# Altium schematic sheet ESP32.SchDoc
size A4
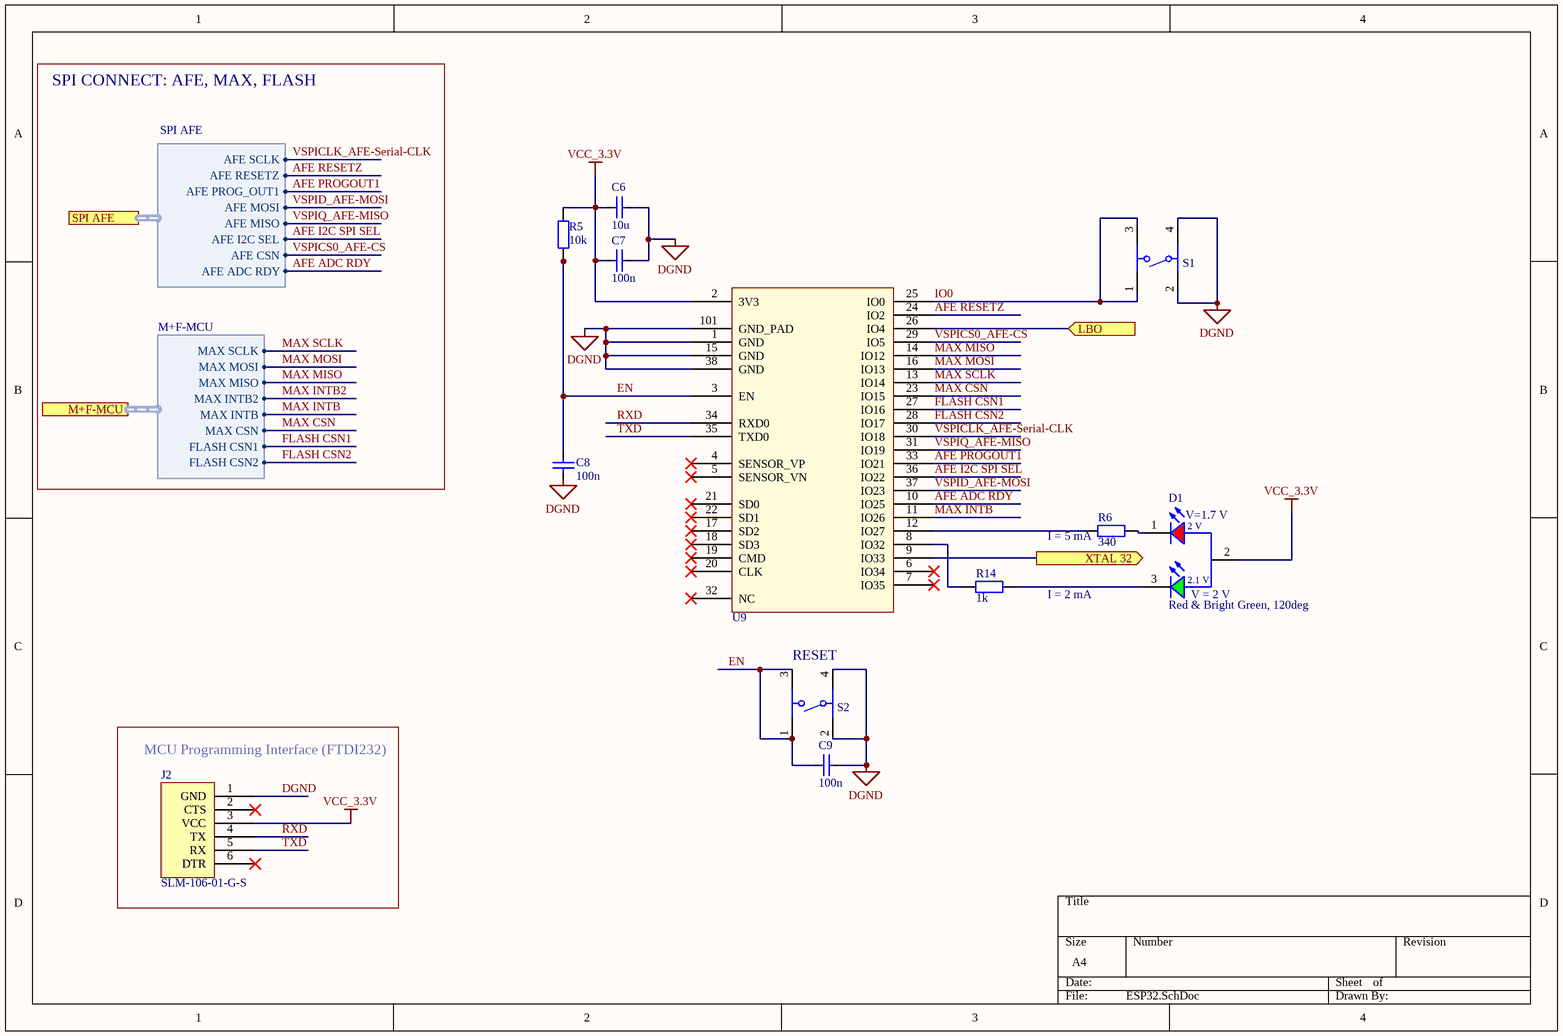
[diagram p0: ESP32.SchDoc]

## Parts
C6  10u  [CAPC1608X05N]
C7  100n  [CAPC1005X03N]
C8  100n  [CAPC1005X03N]
C9  100n  [CAPC1005X03N]
D1  Red & Bright Green, 120deg  [WL-SBSW_1204]
J2  SLM-106-01-G-S  [SLM-106-01-G-S]
R5  10k  [RESC1005X03N]
R6  340  [RESC1005X03N]
R14  1k  [RESC1005X03N]
S1  434153017835  [434153017835]  (value not drawn)
S2  434153017835  [434153017835]  (value not drawn)
U9  ESP32  [ESP32-WROOM-32]  (value not drawn)

## Blocks framed on the sheet
MCU Programming Interface (FTDI232): J2

## Ports
LBO (in), M+F-MCU (harness M+F-MCU), SPI AFE (harness SPI AFE), XTAL 32 (out)

## Harnesses
M+F-MCU: MAX CSN, MAX INTB, MAX INTB2, MAX MISO, MAX MOSI, MAX SCLK, FLASH CSN1, FLASH CSN2
SPI AFE: AFE ADC RDY, AFE CSN, AFE I2C SEL, AFE MISO, AFE MOSI, AFE PROG_OUT1, AFE RESETZ, AFE SCLK

## Nets
DGND: C6.2 C7.2 C8.1 C9.2 J2.1(GND) S1.2 S1.4 S2.2 S2.4 U9.1(GND) U9.15(GND) U9.38(GND) U9.101(GND_PAD)
VCC_3.3V: C6.1 C7.1 D1.2(A) J2.3(VCC) R5.2 U9.2(3V3)
AFE ADC RDY: U9.10(IO25) ; port SPI AFE.AFE ADC RDY
AFE I2C SPI SEL: U9.36(IO22) ; port SPI AFE.AFE I2C SEL
AFE PROGOUT1: U9.33(IO21) ; port SPI AFE.AFE PROG_OUT1
AFE RESETZ: U9.24(IO2) ; port SPI AFE.AFE RESETZ
EN: C8.2 C9.1 R5.1 S2.1 S2.3 U9.3(EN)
FLASH CSN1: U9.27(IO16) ; port M+F-MCU.FLASH CSN1
FLASH CSN2: U9.28(IO17) ; port M+F-MCU.FLASH CSN2
IO0: S1.1 S1.3 U9.25(IO0)
LBO: U9.26(IO4) ; port LBO
MAX CSN: U9.23(IO15) ; port M+F-MCU.MAX CSN
MAX INTB: U9.11(IO26) ; port M+F-MCU.MAX INTB
MAX INTB2: port M+F-MCU.MAX INTB2
MAX MISO: U9.14(IO12) ; port M+F-MCU.MAX MISO
MAX MOSI: U9.16(IO13) ; port M+F-MCU.MAX MOSI
MAX SCLK: U9.13(IO14) ; port M+F-MCU.MAX SCLK
RXD: J2.4(TX) U9.34(RXD0)
TXD: J2.5(RX) U9.35(TXD0)
VSPICLK_AFE-Serial-CLK: U9.30(IO18) ; port SPI AFE.AFE SCLK
VSPICS0_AFE-CS: U9.29(IO5) ; port SPI AFE.AFE CSN
VSPID_AFE-MOSI: U9.37(IO23) ; port SPI AFE.AFE MOSI
VSPIQ_AFE-MISO: U9.31(IO19) ; port SPI AFE.AFE MISO
XTAL 32: U9.9(IO33) ; port XTAL 32
NetD1_1: D1.1(K) R6.2
NetD1_3: D1.3(K) R14.2
NetR6_1: R6.1 U9.12(IO27)
NetR14_1: R14.1 U9.8(IO32)

Not connected (* = marked no-connect by the designer): J2 2(CTS)* 6(DTR)*; U9 4(SENSOR_VP)* 5(SENSOR_VN)* 6(IO34)* 7(IO35)* 17(SD2)* 18(SD3)* 19(CMD)* 20(CLK)* 21(SD0)* 22(SD1)* 32(NC)*

## Notes on the sheet
- SPI CONNECT: AFE, MAX, FLASH
- (near D1) V=1.7 V
- (near R6) I = 5 mA
- I = 2 mA
- (near D1) V = 2 V
- (near S2) RESET
- (in symbol 155124RV73200) 2 V; 2.1 V

## Library data of the parts
C6 = C_10u_10V_0603: Kondensator 10u 10V 0603; Supplier 1: Farnell; Supplier Part Number 1: 2521952
C7-C9 = C_100n_50V_0402: Kondensator 100n 50V 0402; Tested: False; Supplier 1: Farnell; Supplier Part Number 1: 2210822
D1 = 155124RV73200: WL-SBSW SMT Bi-color Side View Waterclear, size 1204, Red & Bright Green, 120deg; Luminous Intensity: 60mcd@Red, 30mcd@Bright Green; Dominant Wavelength: 624nm@Red, 571nm@Bright Green; Forward Voltage: 2V@Red, 2.1V@Bright Green; Peak Wavelength: 632nm@Red, 573nm@Bright Green; Chip Technology: AlInGaP; ComponentLink1Description: Manufacturer; ComponentLink1URL: http://www.we-online.de; ComponentLink2Description: Datasheet; ComponentLink2URL: https://katalog.we-online.de/led/datasheet/155124RV73200.pdf; Emitting Color: Red & Bright Green; Operating Temperature: -40 to +85degC; Mounting Technology: SMT; Part Number: 155124RV73200; Packaging: Tape and Reel; Published Date: October 2019; Publisher: Wurth Elektronik; Size: 1204; Viewing Angle: 120deg
R5 = R_10k_0402: Widerstand 10k 1% 0402; Tested: False; Supplier 1: Farnell; Supplier Part Number 1: 1358069
R6 = R_0R_0402: Widerstand 340R 0402; Tested: True; Supplier 1: Farnell; Supplier Part Number 1: 2059190
R14 = R_1k_0402: Widerstand 1k 1% 0402; Tested: False; Supplier 1: Farnell; Supplier Part Number 1: 2447120
S1 S2 = 434153017835: 3.5x2.9mm SMD J-Bend WS-TASV, height 1.7 mm, 350 gf; Rated Current: 50 mA; Operation Force: 350 gf; Rated Voltage: 12 VDC; ComponentLink1Description: Manufacturer; ComponentLink1URL: http://www.we-online.de; ComponentLink2Description: Datasheet; ComponentLink2URL: http://katalog.we-online.de/em/datasheet/434153017835.pdf; Part Number: 434153017835; Published Date: Nov. 2017; Publisher: Wurth Elektronik; Life Cycle: 200000; Operating Temperature: -40 to +85 degC; Size: 3.5x2.9x1.7 mm
U9 = ESP32-WROOM32: Espressiv ESP32-WROOM32 WLAN Bluetooth Module; HelpURL: https://www.espressif.com/en/products/hardware/esp-wroom-32/overview